# Altium schematic sheet 10_Power.SchDoc: Power (part 1 of 2)
size A3; Organization: Lime Microsystems; Address1: Surrey Tech Centre; Address2: Guildford GU2 7YG; Address3: Surrey; Address4: United Kingdom; Revision: v1.1; SheetNumber: 12; SheetTotal: 12
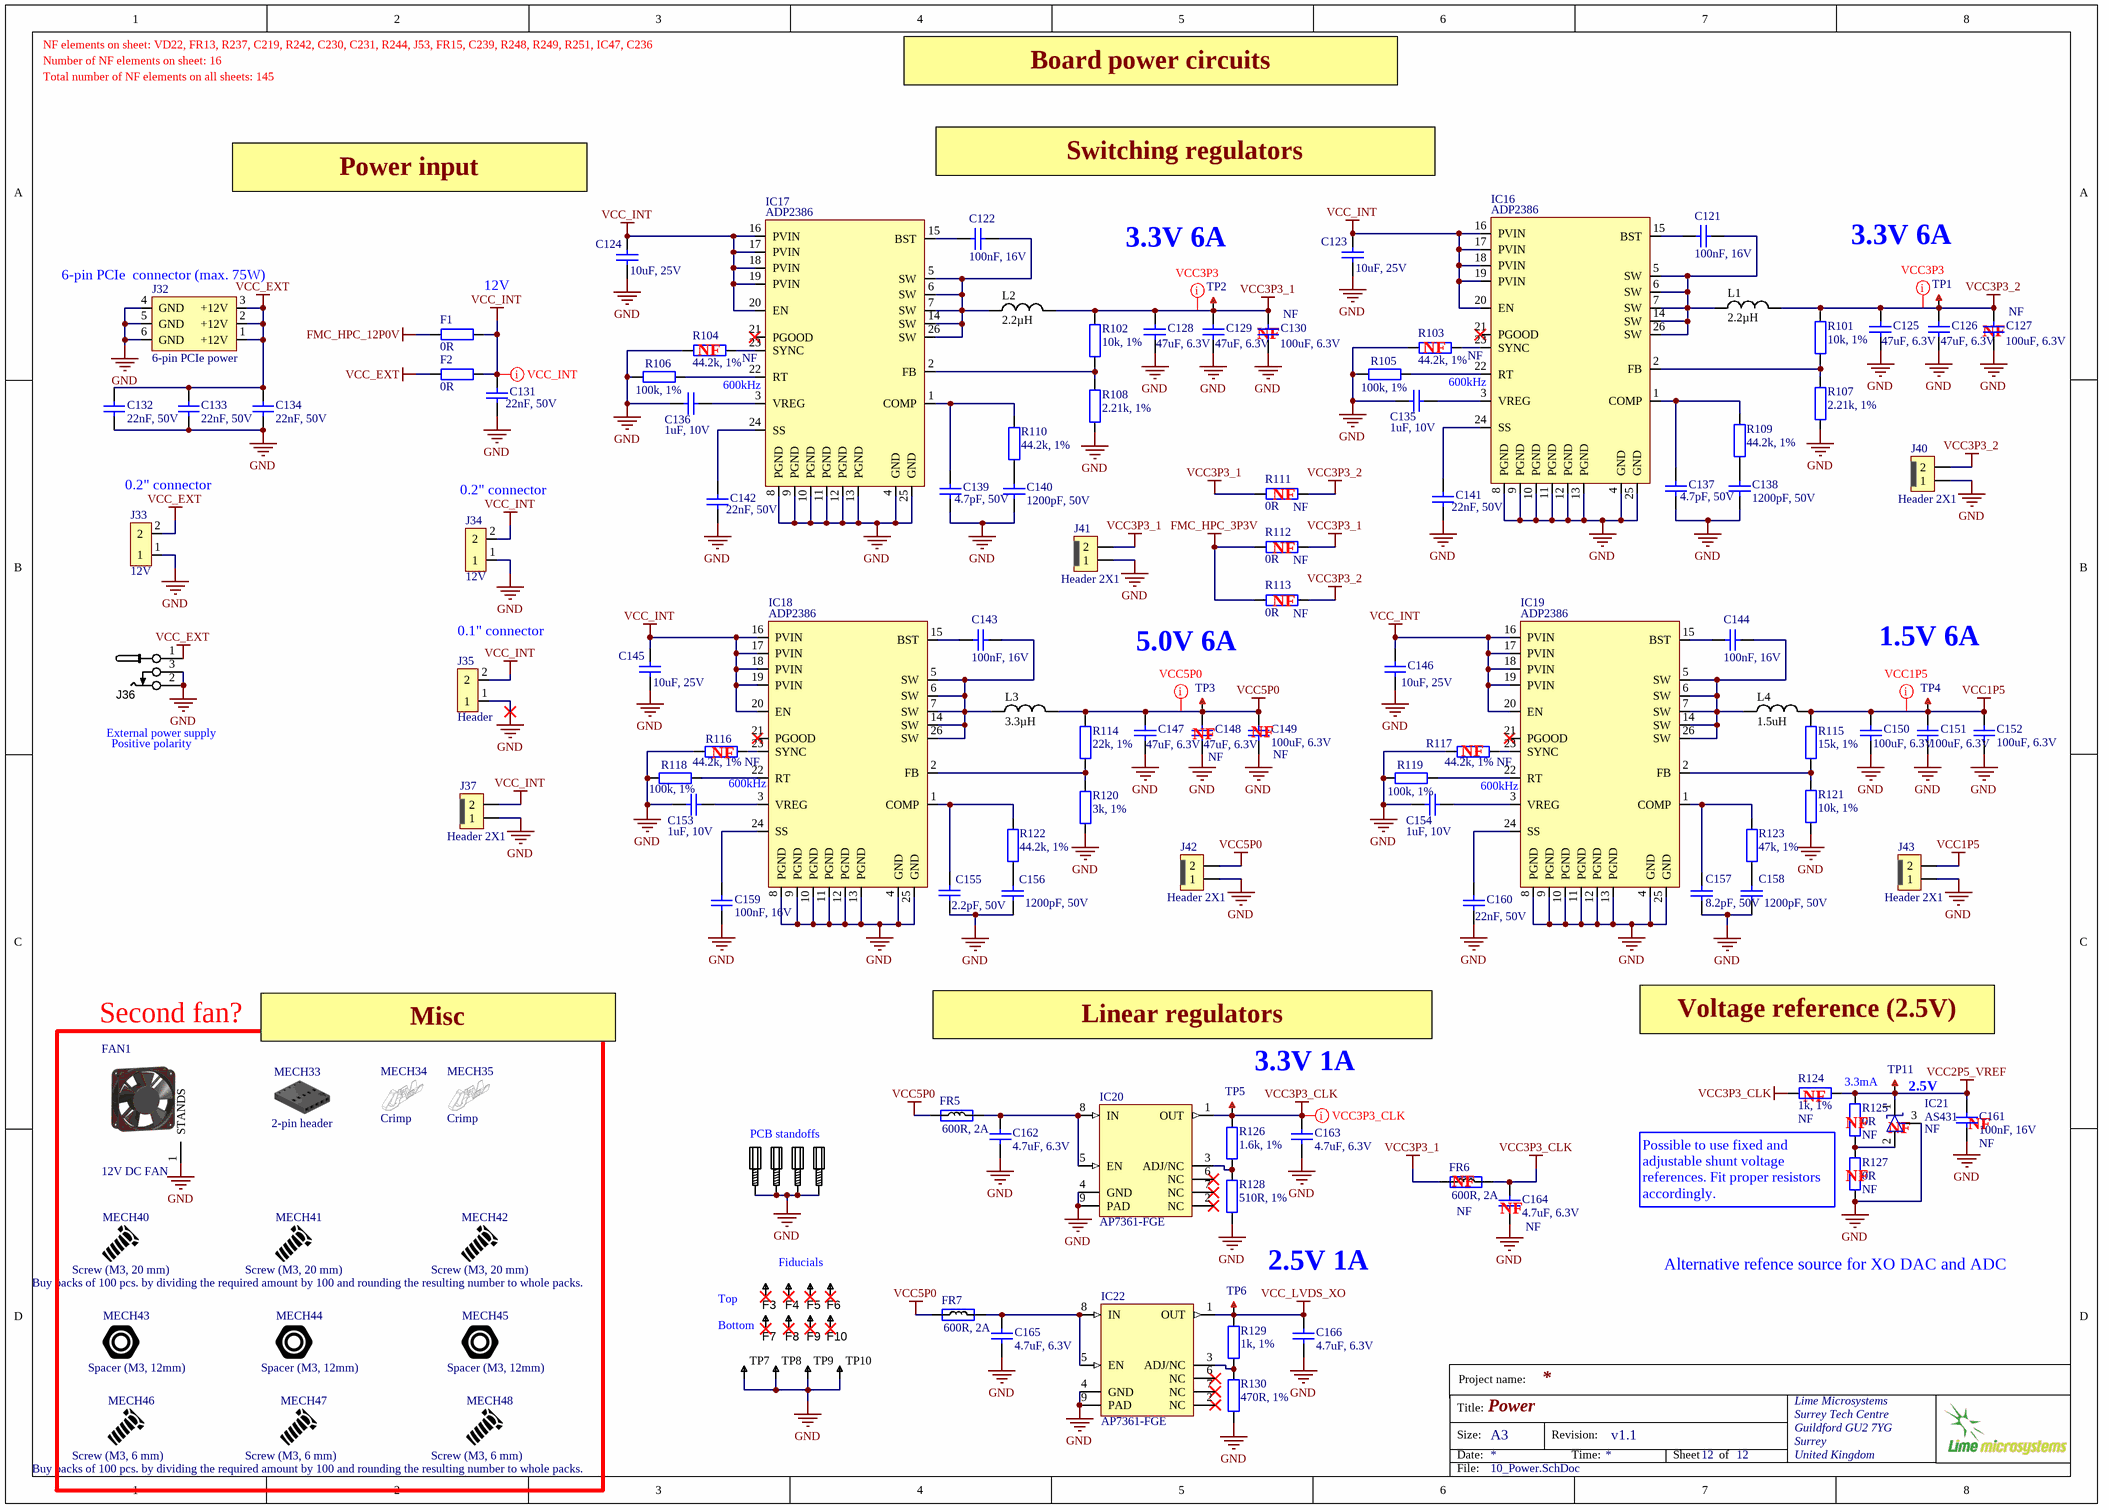
[diagram p0: 10_Power.SchDoc]

## Parts
C121  100nF, 16V  [CAP0402]
C122  100nF, 16V  [CAP0402]
C123  10uF, 25V  [CAP0805]
C124  10uF, 25V  [CAP0805]
C125  47uF, 6.3V  [CAP1206]
C126  47uF, 6.3V  [CAP1206]
C127  100uF, 6.3V  Assembly Info: NF  [CAP1206]
C128  47uF, 6.3V  [CAP1206]
C129  47uF, 6.3V  [CAP1206]
C130  100uF, 6.3V  Assembly Info: NF  [CAP1206]
C131  22nF, 50V  [CAP0402]
C132  22nF, 50V  [CAP0402]
C133  22nF, 50V  [CAP0402]
C134  22nF, 50V  [CAP0402]
C135  1uF, 10V  [CAP0402]
C136  1uF, 10V  [CAP0402]
C137  4.7pF, 50V  [CAP0402]
C138  1200pF, 50V  [CAP0402]
C139  4.7pF, 50V  [CAP0402]
C140  1200pF, 50V  [CAP0402]
C141  22nF, 50V  [CAP0402]
C142  22nF, 50V  [CAP0402]
C143  100nF, 16V  [CAP0402]
C144  100nF, 16V  [CAP0402]
C145  10uF, 25V  [CAP0805]
C146  10uF, 25V  [CAP0805]
C147  47uF, 6.3V  [CAP1206]
C148  47uF, 6.3V  Assembly Info: NF  [CAP1206]
C149  100uF, 6.3V  Assembly Info: NF  [CAP1206]
C150  100uF, 6.3V  [CAP1206]
C151  100uF, 6.3V  [CAP1206]
C152  100uF, 6.3V  [CAP1206]
C153  1uF, 10V  [CAP0402]
C154  1uF, 10V  [CAP0402]
C155  2.2pF, 50V  [CAP0402]
C156  1200pF, 50V  [CAP0402]
C157  8.2pF, 50V  [CAP0402]
C158  1200pF, 50V  [CAP0402]
C159  100nF, 16V  [CAP0402]
C160  22nF, 50V  [CAP0402]
C161  100nF, 16V  Assembly Info: NF  [CAP0402]
C162  4.7uF, 6.3V  [CAP0402]
C163  4.7uF, 6.3V  [CAP0402]
C164  4.7uF, 6.3V  Assembly Info: NF  [CAP0402]
C165  4.7uF, 6.3V  [CAP0402]
C166  4.7uF, 6.3V  [CAP0402]
F1  0R  [RES0805]
F2  0R  [RES0805]
F3  Fiducial  [Fiducial]  (value not drawn)
F4  Fiducial  [Fiducial]  (value not drawn)
F5  Fiducial  [Fiducial]  (value not drawn)
F6  Fiducial  [Fiducial]  (value not drawn)
F7  Fiducial  [Fiducial]  (value not drawn)
F8  Fiducial  [Fiducial]  (value not drawn)
F9  Fiducial  [Fiducial]  (value not drawn)
F10  Fiducial  [Fiducial]  (value not drawn)
FAN1  12V DC FAN  [FAN_80mm]
FR5  600R, 2A  [RES0805]
FR6  600R, 2A  Assembly Info: NF  [RES0805]
FR7  600R, 2A  [RES0805]
IC16  ADP2386  [ADP2386]
IC17  ADP2386  [ADP2386]
IC18  ADP2386  [ADP2386]
IC19  ADP2386  [ADP2386]
IC20  AP7361-FGE  [AP7361]
IC21  AS431  Assembly Info: NF  [SOT23-3_v2]
IC22  AP7361-FGE  [AP7361]
J32  6-pin PCIe power  [PCIe_POWER_HEADER_6PIN]
J33  12V  [1744037-2_CONNECTOR_1X2]
J34  12V  [1744037-2_CONNECTOR_1X2]
J35  Header  [HDR_1x2]
J36  CONN_PWR_JACK_2.1x5.5mm  [CONN_PWR_JACK_v2]  (value not drawn)
J37  Header 2X1  [Header1x2_TH_LOCKING]
J40  Header 2X1  [Header1x2_TH_LOCKING]
J41  Header 2X1  [Header1x2_TH_LOCKING]
J42  Header 2X1  [Header1x2_TH_LOCKING]
J43  Header 2X1  [Header1x2_TH_LOCKING]
L1  2.2µH  [FDVE1040_TOKO_INDUCTOR]
L2  2.2µH  [FDVE1040_TOKO_INDUCTOR]
L3  3.3µH  [FDVE1040_TOKO_INDUCTOR]
L4  1.5uH  [FDVE1040_TOKO_INDUCTOR]
MECH33  2-pin header  (mechanical)
MECH34  Crimp  (mechanical)
MECH35  Crimp  (mechanical)
MECH36  # pcs.  [PCB_standoff]  (value not drawn)
MECH37  # pcs.  [PCB_standoff]  (value not drawn)
MECH38  # pcs.  [PCB_standoff]  (value not drawn)
MECH39  # pcs.  [PCB_standoff]  (value not drawn)
MECH40  Screw (M3, 20 mm)  (mechanical)
MECH41  Screw (M3, 20 mm)  Assembly Info: Buy packs of 100 pcs. by dividing the required amount by 100 and rounding the resulting number to whole packs.  (mechanical)
MECH42  Screw (M3, 20 mm)  (mechanical)
MECH43  Spacer (M3, 12mm)  (mechanical)
MECH44  Spacer (M3, 12mm)  (mechanical)
MECH45  Spacer (M3, 12mm)  (mechanical)
MECH46  Screw (M3, 6 mm)  (mechanical)
MECH47  Screw (M3, 6 mm)  Assembly Info: Buy packs of 100 pcs. by dividing the required amount by 100 and rounding the resulting number to whole packs.  (mechanical)
MECH48  Screw (M3, 6 mm)  (mechanical)
R101  10k, 1%  [RES0402]
R102  10k, 1%  [RES0402]
R103  44.2k, 1%  Assembly Info: NF  [RES0402]
R104  44.2k, 1%  Assembly Info: NF  [RES0402]
R105  100k, 1%  [RES0402]
R106  100k, 1%  [RES0402]
R107  2.21k, 1%  [RES0402]
R108  2.21k, 1%  [RES0402]
R109  44.2k, 1%  [RES0402]
R110  44.2k, 1%  [RES0402]
R111  0R  Assembly Info: NF  [RES0805]
R112  0R  Assembly Info: NF  [RES0805]
R113  0R  Assembly Info: NF  [RES0805]
R114  22k, 1%  [RES0402]
R115  15k, 1%  [RES0402]
R116  44.2k, 1%  Assembly Info: NF  [RES0402]
R117  44.2k, 1%  Assembly Info: NF  [RES0402]
R118  100k, 1%  [RES0402]
R119  100k, 1%  [RES0402]
R120  3k, 1%  [RES0402]
R121  10k, 1%  [RES0402]
R122  44.2k, 1%  [RES0402]
R123  47k, 1%  [RES0402]
R124  1k, 1%  Assembly Info: NF  [RES0402]
R125  0R  Assembly Info: NF  [RES0402]
R126  1.6k, 1%  [RES0402]
R127  0R  Assembly Info: NF  [RES0402]
R128  510R, 1%  [RES0402]
R129  1k, 1%  [RES0402]
R130  470R, 1%  [RES0402]
TP1  TESTPOINT_PAD  [TP_PAD_1p5MM]  (value not drawn)  (no BOM)
TP2  TESTPOINT_PAD  [TP_PAD_1p5MM]  (value not drawn)  (no BOM)
TP3  TESTPOINT_PAD  [TP_PAD_1p5MM]  (value not drawn)  (no BOM)
TP4  TESTPOINT_PAD  [TP_PAD_1p5MM]  (value not drawn)  (no BOM)
TP5  TESTPOINT_PAD  [TP_PAD_1p5MM]  (value not drawn)  (no BOM)
TP6  TESTPOINT_PAD  [TP_PAD_1p5MM]  (value not drawn)  (no BOM)
TP7  TESTPOINT_THT_MINI  [TP-SMD-LOW_PROFILE]  (value not drawn)
TP8  TESTPOINT_THT_MINI  [TP-SMD-LOW_PROFILE]  (value not drawn)
TP9  TESTPOINT_THT_MINI  [TP-SMD-LOW_PROFILE]  (value not drawn)
TP10  TESTPOINT_THT_MINI  [TP-SMD-LOW_PROFILE]  (value not drawn)
TP11  TESTPOINT_PAD  [TP_PAD_1p5MM]  (value not drawn)  (no BOM)

## Blocks framed on the sheet
Second fan?: FAN1 MECH33-MECH35 MECH40-MECH48

## Nets
FMC_HPC_3P3V: R112.2 R113.2
FMC_HPC_12P0V: F1.2
GND: C123.1 C124.1 C125.1 C126.1 C127.1 C128.1 C129.1 C130.1 C131.2 C132.2 C133.2 C134.2 C135.2 C136.2 C137.2 C138.2 C139.2 C140.2 C141.2 C142.2 C145.1 C146.1 C147.1 C148.1 C149.1 C150.1 C151.1 C152.1 C153.2 C154.2 C155.2 C156.2 C157.2 C158.2 C159.1 C160.2 C161.1 C162.1 C163.1 C164.1 C165.1 C166.1 FAN1.1(STANDS) IC16.4(GND) IC16.8(PGND) IC16.9(PGND) IC16.10(PGND) IC16.11(PGND) IC16.12(PGND) IC16.13(PGND) IC16.25(GND) IC17.4(GND) IC17.8(PGND) IC17.9(PGND) IC17.10(PGND) IC17.11(PGND) IC17.12(PGND) IC17.13(PGND) IC17.25(GND) IC18.4(GND) IC18.8(PGND) IC18.9(PGND) IC18.10(PGND) IC18.11(PGND) IC18.12(PGND) IC18.13(PGND) IC18.25(GND) IC19.4(GND) IC19.8(PGND) IC19.9(PGND) IC19.10(PGND) IC19.11(PGND) IC19.12(PGND) IC19.13(PGND) IC19.25(GND) IC20.4(GND) IC20.9(PAD) IC21.3(NC/A) IC22.4(GND) IC22.9(PAD) J32.4(GND) J32.5(GND) J32.6(GND) J33.1 J34.1 J35.1 J36.2 J36.3 J37.1 J40.1 J41.1 J42.1 J43.1 MECH36.MH1 MECH37.MH1 MECH38.MH1 MECH39.MH1 R103.2 R104.2 R105.2 R106.2 R107.1 R108.1 R116.2 R117.2 R118.2 R119.2 R120.1 R121.2 R127.2 R128.2 R130.2 TP7.1 TP8.1 TP9.1 TP10.1
VCC1P5: C150.2 C151.2 C152.2 J43.2 L4.2 R115.2 TP4.1
VCC2P5_VREF: C161.2 IC21.1(K) R124.1 R125.1 TP11.1
VCC3P3_1: C128.2 C129.2 C130.2 FR6.1 J41.2 L2.2 R102.1 R111.2 R112.1 TP2.1
VCC3P3_2: C125.2 C126.2 C127.2 J40.2 L1.2 R101.1 R111.1 R113.1 TP1.1
VCC3P3_CLK: C163.2 C164.2 FR6.2 IC20.1(OUT) R124.2 R126.2 TP5.1
VCC5P0: C147.2 C148.2 C149.2 FR5.1 FR7.1 J42.2 L3.2 R114.2 TP3.1
VCC_EXT: C132.1 C133.1 C134.1 F2.2 J32.1(+12V) J32.2(+12V) J32.3(+12V) J33.2 J36.1
VCC_INT: C123.2 C124.2 C131.1 C145.2 C146.2 F1.1 F2.1 IC16.16(PVIN) IC16.17(PVIN) IC16.18(PVIN) IC16.19(PVIN) IC16.20(EN) IC17.16(PVIN) IC17.17(PVIN) IC17.18(PVIN) IC17.19(PVIN) IC17.20(EN) IC18.16(PVIN) IC18.17(PVIN) IC18.18(PVIN) IC18.19(PVIN) IC18.20(EN) IC19.16(PVIN) IC19.17(PVIN) IC19.18(PVIN) IC19.19(PVIN) IC19.20(EN) J34.2 J35.2 J37.2
VCC_LVDS_XO: C166.2 IC22.1(OUT) R129.2 TP6.1
NetC121_1: C121.1 IC16.15(BST)
NetC121_2: C121.2 IC16.5(SW) IC16.6(SW) IC16.7(SW) IC16.14(SW) IC16.26(SW) L1.1
NetC122_1: C122.1 IC17.15(BST)
NetC122_2: C122.2 IC17.5(SW) IC17.6(SW) IC17.7(SW) IC17.14(SW) IC17.26(SW) L2.1
NetC135_1: C135.1 IC16.3(VREG)
NetC136_1: C136.1 IC17.3(VREG)
NetC137_1: C137.1 IC16.1(COMP) R109.2
NetC138_1: C138.1 R109.1
NetC139_1: C139.1 IC17.1(COMP) R110.2
NetC140_1: C140.1 R110.1
NetC141_1: C141.1 IC16.24(SS)
NetC142_1: C142.1 IC17.24(SS)
NetC143_1: C143.1 IC18.15(BST)
NetC143_2: C143.2 IC18.5(SW) IC18.6(SW) IC18.7(SW) IC18.14(SW) IC18.26(SW) L3.1
NetC144_1: C144.1 IC19.15(BST)
NetC144_2: C144.2 IC19.5(SW) IC19.6(SW) IC19.7(SW) IC19.14(SW) IC19.26(SW) L4.1
NetC153_1: C153.1 IC18.3(VREG)
NetC154_1: C154.1 IC19.3(VREG)
NetC155_1: C155.1 IC18.1(COMP) R122.2
NetC156_1: C156.1 R122.1
NetC157_1: C157.1 IC19.1(COMP) R123.2
NetC158_1: C158.1 R123.1
NetC159_2: C159.2 IC18.24(SS)
NetC160_1: C160.1 IC19.24(SS)
NetC162_2: C162.2 FR5.2 IC20.5(EN) IC20.8(IN)
NetC165_2: C165.2 FR7.2 IC22.5(EN) IC22.8(IN)
NetIC16_2: IC16.2(FB) R101.2 R107.2
NetIC16_22: IC16.22(RT) R105.1
NetIC16_23: IC16.23(SYNC) R103.1
NetIC17_2: IC17.2(FB) R102.2 R108.2
NetIC17_22: IC17.22(RT) R106.1
NetIC17_23: IC17.23(SYNC) R104.1
NetIC18_2: IC18.2(FB) R114.1 R120.2
NetIC18_22: IC18.22(RT) R118.1
NetIC18_23: IC18.23(SYNC) R116.1
NetIC19_2: IC19.2(FB) R115.1 R121.1
NetIC19_22: IC19.22(RT) R119.1
NetIC19_23: IC19.23(SYNC) R117.1
NetIC20_3: IC20.3(ADJ/NC) R126.1 R128.1
NetIC21_2: IC21.2(A) R125.2 R127.1
NetIC22_3: IC22.3(ADJ/NC) R129.1 R130.1

Not connected (* = marked no-connect by the designer): F3 1*; F4 1*; F5 1*; F6 1*; F7 1*; F8 1*; F9 1*; F10 1*; IC16 21(PGOOD)*; IC17 21(PGOOD)*; IC18 21(PGOOD)*; IC19 21(PGOOD)*; IC20 2(NC)* 6(NC)* 7(NC)*; IC22 2(NC)* 6(NC)* 7(NC)*

## Layout directives
net class VCC3P3_CLK: VCC3P3_CLK
net class VCC3P3: VCC3P3_1, VCC3P3_2
net class VCC5P0: VCC5P0
net class VCC1P5: VCC1P5
net class VCC_INT: VCC_INT

## Notes on the sheet
- NF elements on sheet: VD22, FR13, R237, C219, R242, C230, C231, R244, J53, FR15, C239, R248, R249, R251, IC47, C236
- Number of NF elements on sheet: 16
- Total number of NF elements on all sheets: 145
- Board power circuits
- Switching regulators
- Power input
- (near TP2) 3.3V 6A
- (near TP1) 3.3V 6A
- (near J32) 6-pin PCIe  connector (max. 75W)
- (near F1) 12V
- (near R104) NF
- (near C130) NF
- (near R103) NF
- (near C127) NF
- (near IC17) 600kHz
- (near IC16) 600kHz
- 0.2" connector
- (near J34) 0.2" connector
- (near R111) NF
- (near R112) NF
- 0.1" connector
- 5.0V 6A
- (near R113) NF
- (near TP4) 1.5V 6A
- (near J36) External power supply
- (near J36) Positive polarity
- (near R116) NF
- (near IC18) 600kHz
- (near C148) NF
- (near C149) NF
- (near R117) NF
- (near IC19) 600kHz
- Misc
- Linear regulators
- Voltage reference (2.5V)
- 3.3V 1A
- (near R124) NF
- 3.3mA
- 2.5V
- PCB standoffs
- (near FR6) NF
- (near R127) NF
- (near R125) NF
- (near IC21) NF
- (near C161) NF
- (near C164) NF
- Possible to use fixed and adjustable shunt voltage references. Fit proper resistors accordingly.
- Top
- (near F7) Bottom
- Fiducials
- 2.5V 1A
- Alternative refence source for XO DAC and ADC
- Project name:
- Title:
- Size:
- Date:
- A3
- Revision:
- Time:
- Sheet
- of
- File: